# EAGLE design Gustav M sensor board (EAGLE 9.4.0)
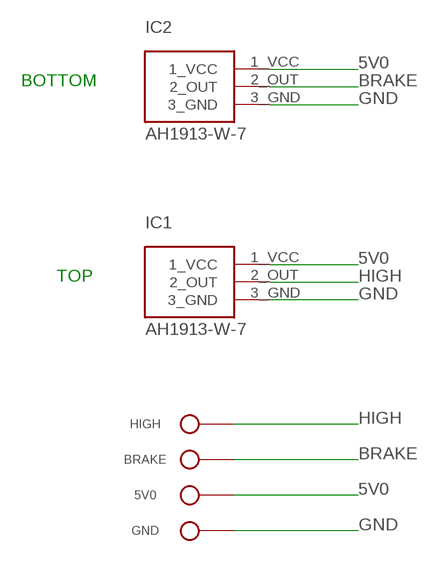
[diagram p0: schematic, sheet 1]

## Parts
5V0  8V4 Battery +  TPTH-0.9MM  [TH-0.9MM]
BRAKE  8V4 Battery +  TPTH-0.9MM  [TH-0.9MM]
GND  8V4 Battery +  TPTH-0.9MM  [TH-0.9MM]
HIGH  8V4 Battery +  TPTH-0.9MM  [TH-0.9MM]
IC1  AH1913-W-7  AD1913  [SC59-3]
IC2  AH1913-W-7  AD1913  [SC59-3]

## Nets
5V0: 5V0.TP$1 IC1.1_VCC IC2.1_VCC
BRAKE: BRAKE.TP$1 IC2.2_OUT
GND: GND.TP$1 IC1.3_GND IC2.3_GND
HIGH: HIGH.TP$1 IC1.2_OUT

## Notes on the sheet
- BOTTOM
- TOP

## Library data of the parts
5V0 BRAKE GND HIGH = signal testpoint:TP
IC1 IC2 = AH1913 - Hall Effect Sensor Switch:AD1913

## Board
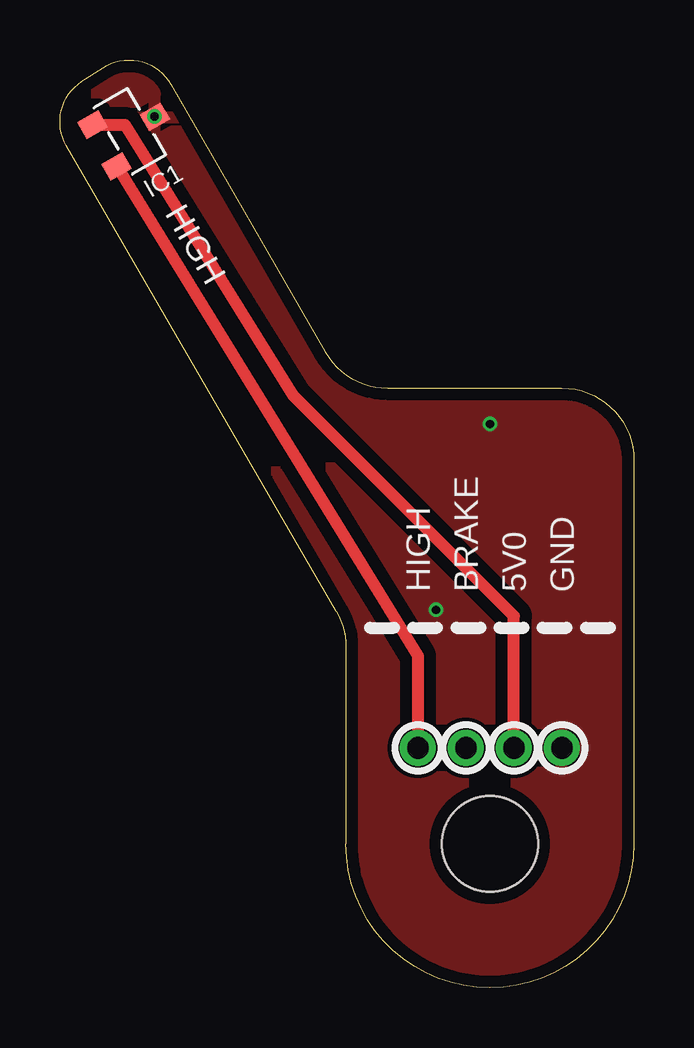
[diagram p1: board, top side]
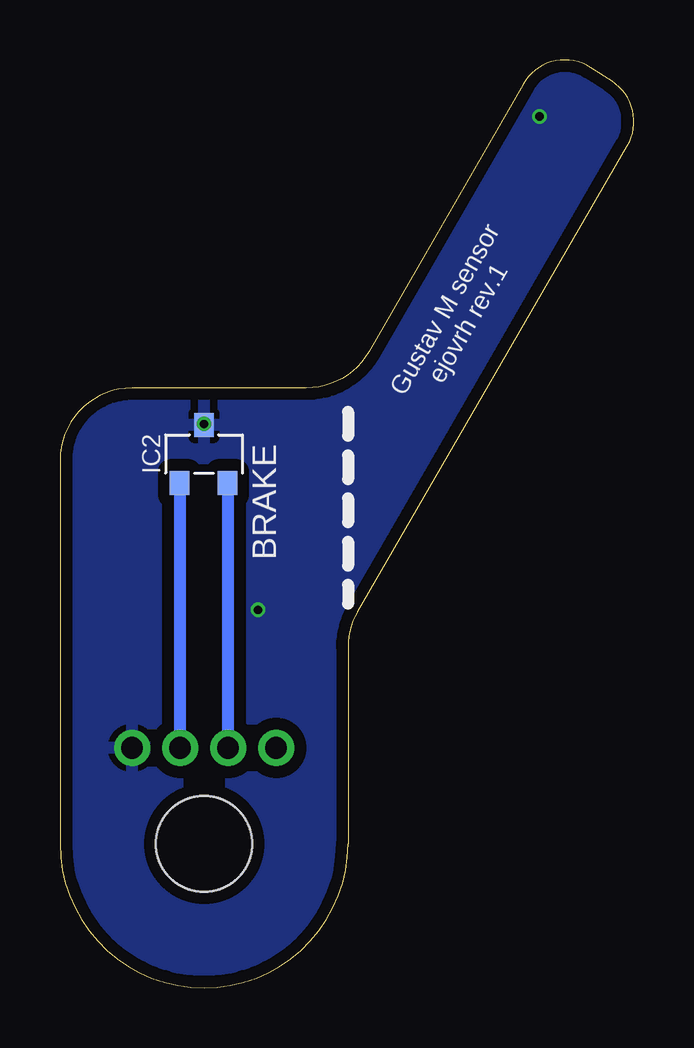
[diagram p2: board, bottom side, seen from below]

Size 23.91 x 38.68 mm. Coordinates in mm from the lower left corner, seen from the top.
Outline: 23.91,6 arc-90 17.91,0 arc-90 11.91,6 11.91,14.2 arc30 11.51,15.7 0.27,35.1 arc-87 0.91,37.78 1.79,38.36 arc-93 4.61,37.67 11.05,26.51 arc60 13.65,25 20.91,25 arc-90 23.91,22 23.91,6
Copper layers (1*16): Top 0.035559375mm / dielectric 1.6mm / Bottom 0.035559375mm
Design rules "oshpark-2layer": minimum track width 6mil, minimum drill 10mil, track to track 6mil, track to pad 6mil, pad to pad 6mil, via to via 6mil, smd to smd 6mil, copper to edge 15mil, drill to drill 6mil, minimum pad ring 5mil, minimum via ring 5mil, stop-mask expansion 2.5mil, vias tented up to drill 0mil, thermal gap 10mil
Holes 4 mm at 17.91,6

### Footprints (pad centres in the part's own frame; a part is rotated, then mirrored left to right if it is on the bottom)
TH-0.9MM = drill 0.9 pad 1.5: TP$1 0,0
SC59-3 = smd 0.8 x 1: 1_VCC -1.02,-1.21; 2_OUT 0.98,-1.21; 3_GND 0,1.2

### Placement (x,y rotation side)
5V0  18.91,10 0 top
BRAKE  16.91,10 0 top
GND  20.91,10 0 top
HIGH  14.91,10 0 top
IC1  2.91,35.7 300 top
IC2  17.91,22.25 0 bottom

### Tracks (layer width: path | path; a pad name or v marks a point on that pad's centre or on a via)
5V0
  Top 0.508: IC1.1_VCC 2.71,35.98 9.73,24.68 18.91,15.49 5V0.TP$1
  Bottom 0.508: 5V0.TP$1 18.91,21.02 IC2.1_VCC
BRAKE
  Bottom 0.508: BRAKE.TP$1 16.91,21.02 IC2.2_OUT
GND  (via drill 0.35)
  other vias: 17.91,23.5 3.94,36.33 15.66,15.75
  pour Top (isolate 0.5): -0.59,39.25 28.91,39.25 28.91,-1 -0.59,-1
  pour Bottom (isolate 0.5): -4.59,39.25 24.91,39.25 24.91,-1 -4.59,-1
HIGH
  Top 0.508: HIGH.TP$1 14.91,13.82 IC1.2_OUT

### Text on the board
tPlace: HIGH
bPlace: Gustav M sensor / ejovrh rev.1 | BRAKE